# EAGLE design LN_Weiche_SignalMPX (EAGLE 7.7.0)
LocoNet Arduino Basisboard für piggyback PCBs
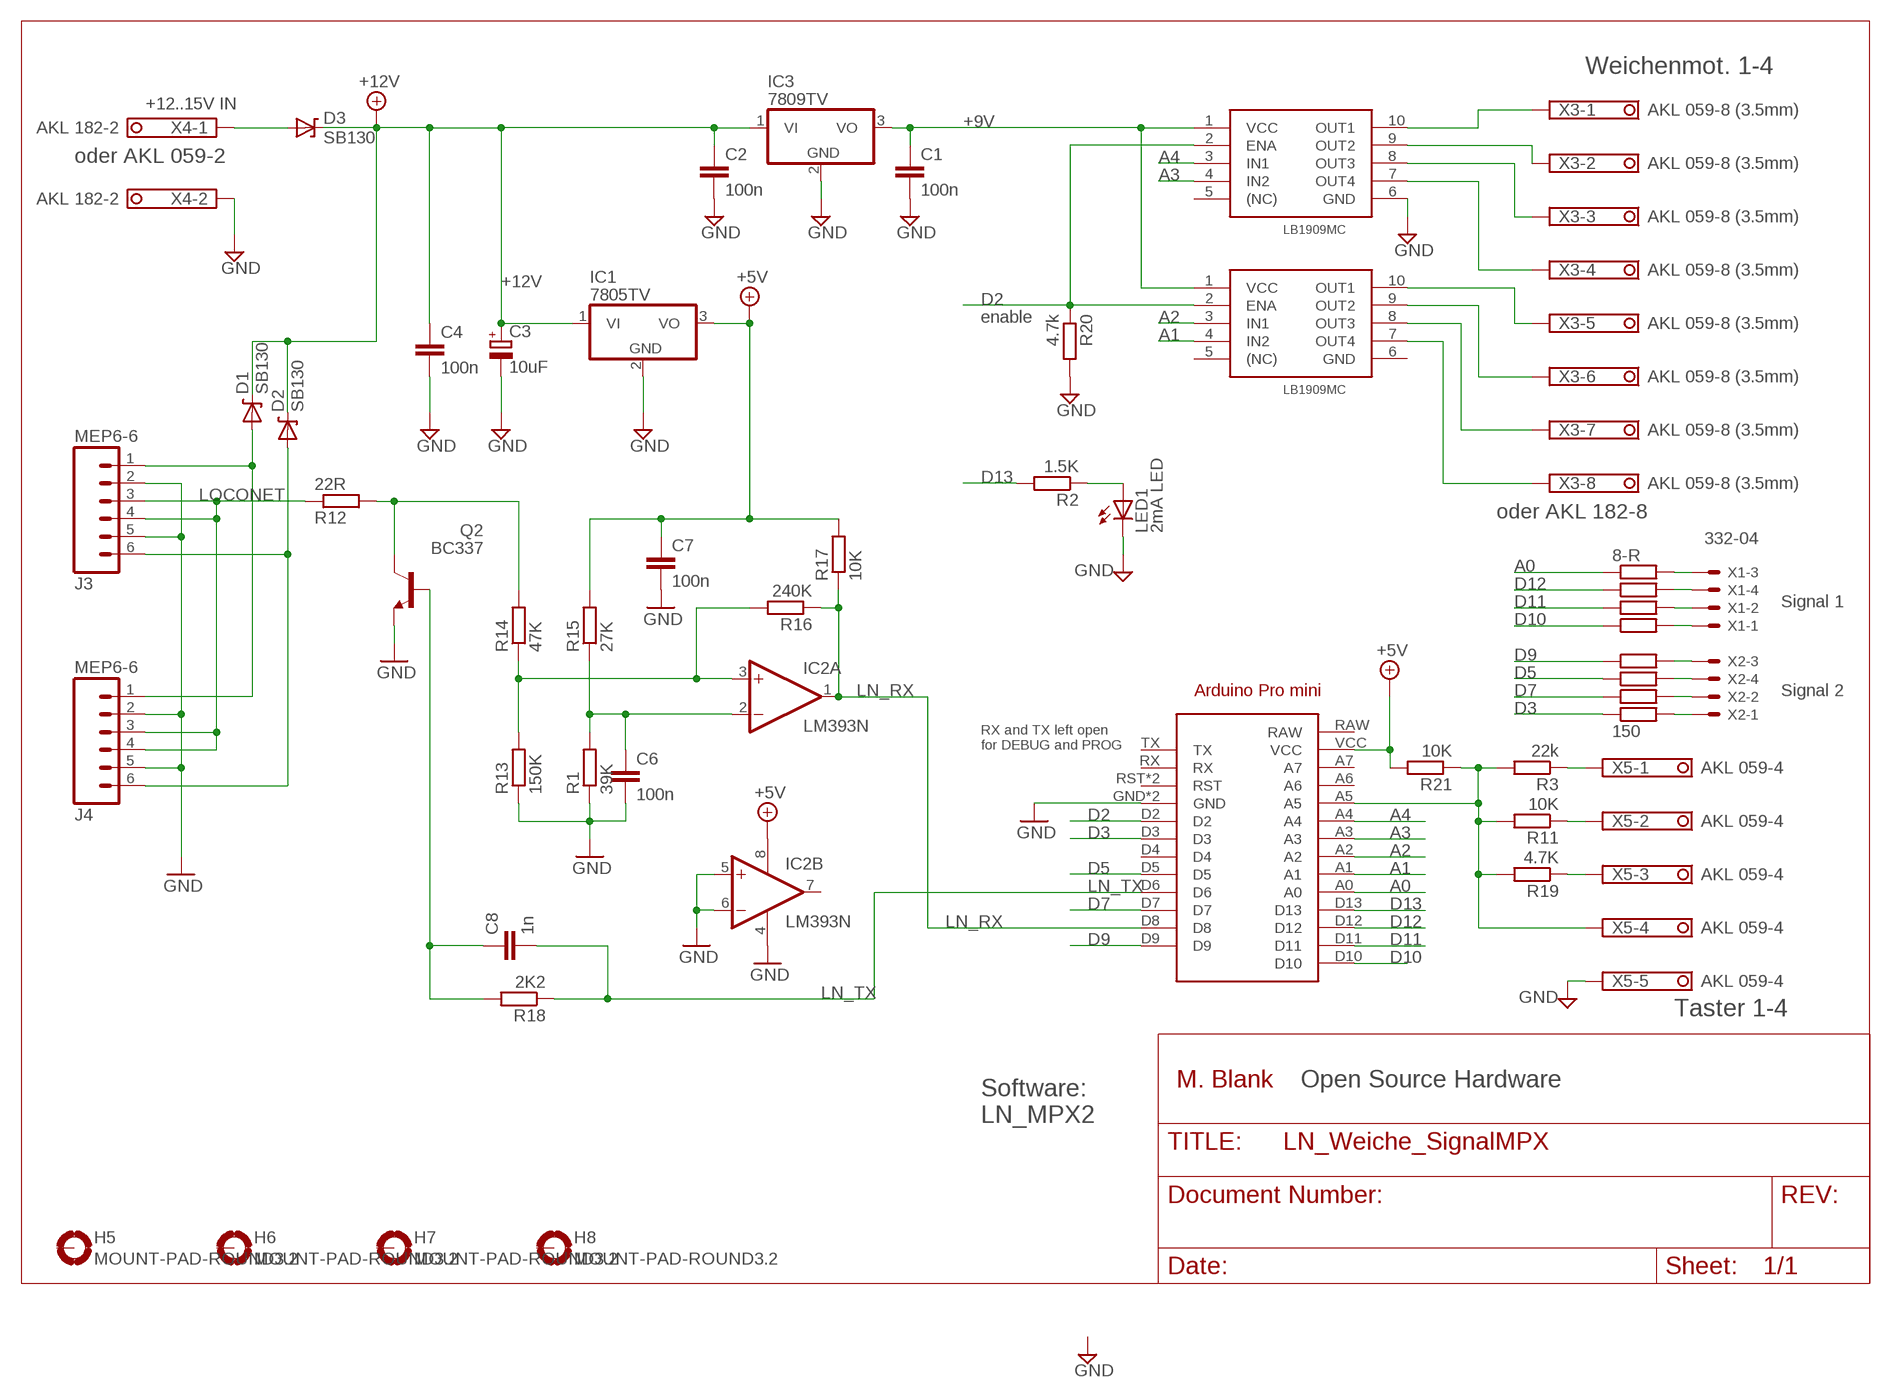
[diagram p0: schematic, sheet 1]

## Parts
8-R  150  R-EU_0207/10  [0207/10]
ARDUINO1  ARDUINO_PRO_MINI  [ARDUINO_PRO_MINI]
C1  100n  C-EU050-025X075  [C050-025X075]
C2  100n  C-EU050-025X075  [C050-025X075]
C3  10uF  CPOL-EUE2.5-7  [E2,5-7]
C4  100n  C-EU050-025X075  [C050-025X075]
C6  100n  C-EU050-025X075  [C050-025X075]
C7  100n  C-EU050-025X075  [C050-025X075]
C8  1n  C-EU025-025X050  [C025-025X050]
D1  SB130  DIODE-ZENERPTH  [DIODE-ZENER]
D2  SB130  DIODE-ZENERPTH  [DIODE-ZENER]
D3  SB130  DIODE-ZENERPTH  [DIODE-ZENER]
H5  MOUNT-PAD-ROUND3.2  [3,2-PAD]
H6  MOUNT-PAD-ROUND3.2  [3,2-PAD]
H7  MOUNT-PAD-ROUND3.2  [3,2-PAD]
H8  MOUNT-PAD-ROUND3.2  [3,2-PAD]
IC1  7805TV  [TO220V]
IC2  LM393N  [DIL08]
IC3  7809TV  7805TV  [TO220V]
J3  MEP6-6  RJ11-6PTH  [RJ11-6]
J4  MEP6-6  RJ11-6PTH  [RJ11-6]
LB1909MC-1  LB1909MC  LB1909SOIC10  [MSOIC10-1MM]
LB1909MC-2  LB1909MC  LB1909SOIC10  [MSOIC10-1MM]
LED1  2mA LED  LED3MM  [LED3MM]
Q2  BC337  [TO92]
R1  39K  R-EU_0207/10  [0207/10]
R2  1.5K  R-EU_0207/10  [0207/10]
R3  22k  R-EU_0207/10  [0207/10]
R4  150  R-EU_0207/10  [0207/10]
R5  150  R-EU_0207/10  [0207/10]
R6  150  R-EU_0207/10  [0207/10]
R7  150  R-EU_0207/10  [0207/10]
R8  150  R-EU_0207/10  [0207/10]
R9  150  R-EU_0207/10  [0207/10]
R10  150  R-EU_0207/10  [0207/10]
R11  10K  R-EU_0207/10  [0207/10]
R12  22R  R-EU_0207/10  [0207/10]
R13  150K  R-EU_0207/10  [0207/10]
R14  47K  R-EU_0207/10  [0207/10]
R15  27K  R-EU_0207/10  [0207/10]
R16  240K  R-EU_0207/10  [0207/10]
R17  10K  R-EU_0207/10  [0207/10]
R18  2K2  R-EU_0207/10  [0207/10]
R19  4.7K  R-EU_0207/10  [0207/10]
R20  4.7k  R-EU_0207/10  [0207/10]
R21  10K  R-EU_0207/10  [0207/10]
X1  332-04  [332-04]
X2  332-04  [332-04]
X3  AKL 059-8 (3.5mm)  1751303  [1751303]
X4  AKL 182-2  1751248  [1751248]
X5  AKL 059-4  1751277  [1751277]

## Nets
+5V: ARDUINO1.VCC C7.1 IC1.3(VO) IC2.8(P:V+) R15.2 R17.2 R21.2
+9V: C1.1 IC3.3(VO) LB1909MC-1.1(VCC) LB1909MC-2.1(VCC)
+12V: C2.1 C3.+ C4.1 D1.P$1(C) D2.P$1(C) D3.P$1(C) IC1.1(VI) IC3.1(VI)
A0: 8-R.1 ARDUINO1.A0
A1: ARDUINO1.A1 LB1909MC-2.4(IN2)
A2: ARDUINO1.A2 LB1909MC-2.3(IN1)
A3: ARDUINO1.A3 LB1909MC-1.4(IN2)
A4: ARDUINO1.A4 LB1909MC-1.3(IN1)
D2: ARDUINO1.D2 LB1909MC-1.2(ENA) LB1909MC-2.2(ENA) R20.1
D3: ARDUINO1.D3 R10.1
D5: ARDUINO1.D5 R8.1
D7: ARDUINO1.D7 R9.1
D9: ARDUINO1.D9 R7.1
D10: ARDUINO1.D10 R6.1
D11: ARDUINO1.D11 R5.1
D12: ARDUINO1.D12 R4.1
D13: ARDUINO1.D13 R2.2
GND: ARDUINO1.GND ARDUINO1.GND@1(GND) C1.2 C2.2 C3.- C4.2 C6.2 C7.2 IC1.2(GND) IC2.4(P:V-) IC2.5(B:+IN) IC2.6(B:-IN) IC3.2(GND) J3.2 J3.5 J4.2 J4.5 LB1909MC-1.6(GND) LED1.K(C) Q2.1(E) R1.1 R13.1 R20.2 X4.2 X5.5
LN_RX: ARDUINO1.D8 IC2.1(A:OUT) R16.1 R17.1
LN_TX: ARDUINO1.D6 C8.2 R18.1
LOCONET: J3.3 J3.4 J4.3 J4.4 R12.1
N$1: LED1.A R2.1
N$2: LB1909MC-1.10(OUT1) X3.1
N$3: LB1909MC-1.9(OUT2) X3.2
N$4: LB1909MC-1.8(OUT3) X3.3
N$5: LB1909MC-1.7(OUT4) X3.4
N$6: 8-R.2 X1.3
N$7: R4.2 X1.4
N$8: R5.2 X1.2
N$9: R6.2 X1.1
N$10: D3.P$2(A) X4.1
N$11: R7.2 X2.3
N$12: R8.2 X2.4
N$13: R9.2 X2.2
N$14: R10.2 X2.1
N$15: LB1909MC-2.10(OUT1) X3.5
N$16: LB1909MC-2.9(OUT2) X3.6
N$17: LB1909MC-2.8(OUT3) X3.7
N$18: LB1909MC-2.7(OUT4) X3.8
N$19: ARDUINO1.A5 R3.2 R11.2 R19.2 R21.1 X5.4
N$20: R3.1 X5.1
N$21: R11.1 X5.2
N$22: R19.1 X5.3
N$28: D1.P$2(A) J3.1 J4.1
N$29: C6.1 IC2.2(A:-IN) R1.2 R15.1
N$30: C8.1 Q2.2(B) R18.2
N$32: IC2.3(A:+IN) R13.2 R14.1 R16.2
N$36: Q2.3(C) R12.2 R14.2
N$37: D2.P$2(A) J3.6 J4.6
Unconnected: ARDUINO1.A6 ARDUINO1.A7 ARDUINO1.D4 ARDUINO1.RAW ARDUINO1.RST ARDUINO1.RST@1(RST) ARDUINO1.RX ARDUINO1.TX H5.B3,2(MOUNT) H6.B3,2(MOUNT) H7.B3,2(MOUNT) H8.B3,2(MOUNT) IC2.7(B:OUT) LB1909MC-1.5((NC)) LB1909MC-2.5((NC))

## Notes on the sheet
- Weichenmot. 1-4
- +12..15V IN
- oder AKL 059-2
- enable
- oder AKL 182-8
- Signal 1
- Signal 2
- RX and TX left open
  for DEBUG and PROG
- Taster 1-4
- M. Blank | Open Source Hardware
- Software: 
  LN_MPX2

## Power pins joined to a net without a drawn wire
GND: LB1909MC-2.6(GND)

## Library data of the parts
8-R R4-R10 R20 = resistor:R-EU_: RESISTOR, European symbol
ARDUINO1 = lib-arduino-pro-mini67:ARDUINO_PRO_MINI: For creating Arduino Pro Mini shields
C1 = resistor:C-EU: CAPACITOR, European symbol
C2 C4 C6-C8 = rcl:C-EU: CAPACITOR, European symbol
C3 = resistor:CPOL-EU: POLARIZED CAPACITOR, European symbol
D1-D3 = SparkFun-DiscreteSemi:DIODE-ZENER: Zener Diode Production Part - 8199 3.4V Zener Voltage
H5-H8 = holes:MOUNT-PAD-ROUND: MOUNTING PAD, round
IC1 IC3 = linear:78*: Positive VOLTAGE REGULATOR Source: http://cache.national.com/ds/LM/LM78L05.pdf http://www.fairchildsemi.com/ds/LM/LM7805.pdf
IC2 = linear:LM393: COMPARATOR
J3 J4 = SparkFun-Connectors:RJ11-6: RJ11 Jack Simple 6 pin RJ11 jack. Commonly found on CAT3 devices and Microchip programmers. SKU: PRT-00132
LB1909MC-1 LB1909MC-2 = lb1909:LB1909: LB1909MC Motor Driver
LED1 = led:LED: LED OSRAM: - CHIPLED LG R971, LG N971, LY N971, LG Q971, LY Q971, LO R971, LY R971 LH N974, LH R974 LS Q976, LO Q976, LY Q976 LO Q996 - Hyper CHIPLED LW Q18S LB Q993, LB Q99A, LB R99A - SideLED LS A670, LO A670, LY A670, LG A670, LP A670 LB A673, LV A673, LT A673, LW A673 LH A674 LY A675 LS A676, LA A676, LO A676, LY A676, LW A676 LS A679, LY A679, LG A679 - Hyper Micro SIDELED® LS Y876, LA Y876, LO Y876, LY Y876 LT Y87S - SmartLED LW L88C, LW L88S LB L89C, LB L89S, LG L890 LS L89K, LO L89K, LY L89K LS L896, LA L896, LO L896, LY L896 - TOPLED LS T670, LO T670, LY T670, LG T670, LP T670 LSG T670, LSP T670, LSY T670, LOP T670, LYG T670 LG T671, LOG T671, LSG T671 LB T673, LV T673, LT T673, LW T673 LH T674 LS T676, LA T676, LO T676, LY T676, LB T676, LH T676, LSB T676, LW T676 LB T67C, LV T67C, LT T67C, LS T67K, LO T67K, LY T67K, LW E67C LS E67B, LA E67B, LO E67B, LY E67B, LB E67C, LV E67C, LT E67C LW T67C LS T679, LY T679, LG T679 LS T770, LO T770, LY T770, LG T770, LP T770 LB T773, LV T773, LT T773, LW T773 LH T774 LS E675, LA E675, LY E675, LS T675 LS T776, LA T776, LO T776, LY T776, LB T776 LHGB T686 LT T68C, LB T68C - Hyper Mini TOPLED® LB M676 - Mini TOPLED Santana® LG M470 LS M47K, LO M47K, LY M47K Source: http://www.osram.convergy.de LUXEON: - LUMILED® LXK2-PW12-R00, LXK2-PW12-S00, LXK2-PW14-U00, LXK2-PW14-V00 LXK2-PM12-R00, LXK2-PM12-S00, LXK2-PM14-U00 LXK2-PE12-Q00, LXK2-PE12-R00, LXK2-PE12-S00, LXK2-PE14-T00, LXK2-PE14-U00 LXK2-PB12-K00, LXK2-PB12-L00, LXK2-PB12-M00, LXK2-PB14-N00, LXK2-PB14-P00, LXK2-PB14-Q00 LXK2-PR12-L00, LXK2-PR12-M00, LXK2-PR14-Q00, LXK2-PR14-R00 LXK2-PD12-Q00, LXK2-PD12-R00, LXK2-PD12-S00 LXK2-PH12-R00, LXK2-PH12-S00 LXK2-PL12-P00, LXK2-PL12-Q00, LXK2-PL12-R00 Source: www.luxeon.com KINGBRIGHT: KA-3528ASYC Source: www.kingbright.com
Q2 = transistor-npn:BC337*: NPN Transistor
R1-R3 R11-R19 R21 = rcl:R-EU_: RESISTOR, European symbol
X1 X2 = con-garry:332-04: 4 Pin - 2mm Dual Row Source: www.mpe-connector.de / garry_shortform_2012.pdf
X3 = con-phoenix-350-grosse-bohrungen:1751303: MKDS 1/ 8-3,5 Printklemme Nennstrom: 10 A Bemessungsspannung: 160 V Raster: 3,5 mm Polzahl: 8 Montageart: Löten Anschlussart: Schraubanschluss Anschlussrichtung vom Leiter zur Platine: 0° Source: http://eshop.phoenixcontact.com .. .pdf; OC_FARNELL: unknown; OC_NEWARK: unknown
X4 = con-phoenix-350-grosse-bohrungen:1751248: MKDS 1/ 2-3,5 Printklemme Nennstrom: 10 A Bemessungsspannung: 160 V Raster: 3,5 mm Polzahl: 2 Montageart: Löten Anschlussart: Schraubanschluss Anschlussrichtung vom Leiter zur Platine: 0° Source: http://eshop.phoenixcontact.com .. 1751248.pdf; OC_FARNELL: unknown; OC_NEWARK: unknown
X5 = con-phoenix-350-grosse-bohrungen:1751277: MKDS 1/ 5-3,5 Printklemme Nennstrom: 10 A Bemessungsspannung: 160 V Raster: 3,5 mm Polzahl: 5 Montageart: Löten Anschlussart: Schraubanschluss Anschlussrichtung vom Leiter zur Platine: 0° Source: http://eshop.phoenixcontact.com .. 1751277.pdf; OC_FARNELL: unknown; OC_NEWARK: unknown

## Board
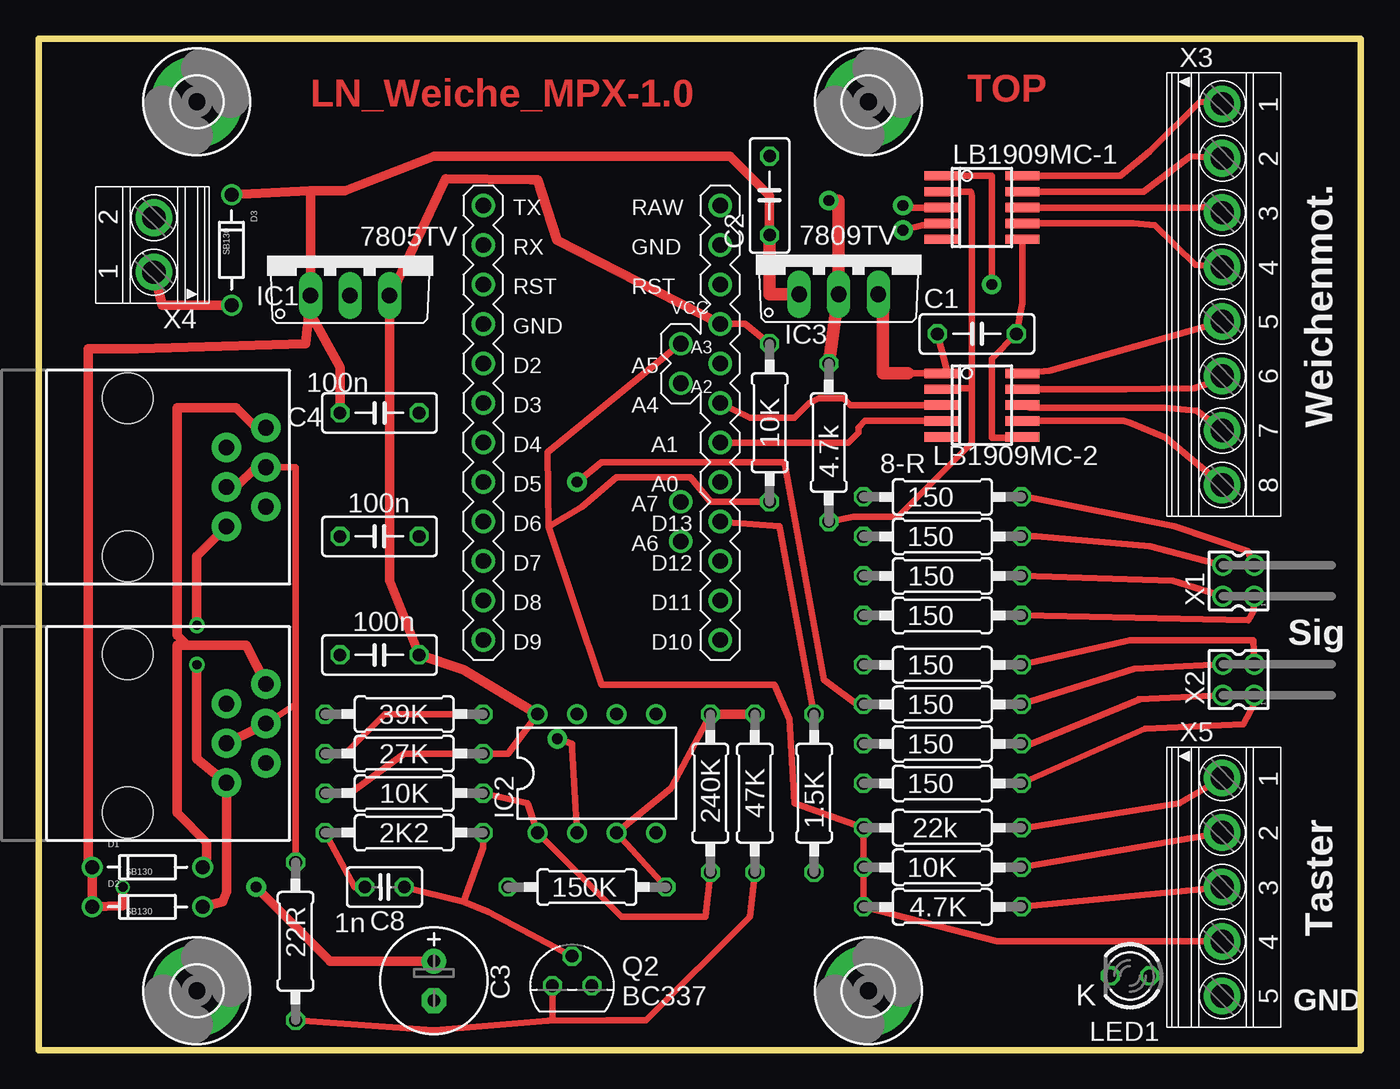
[diagram p1: board, top side]
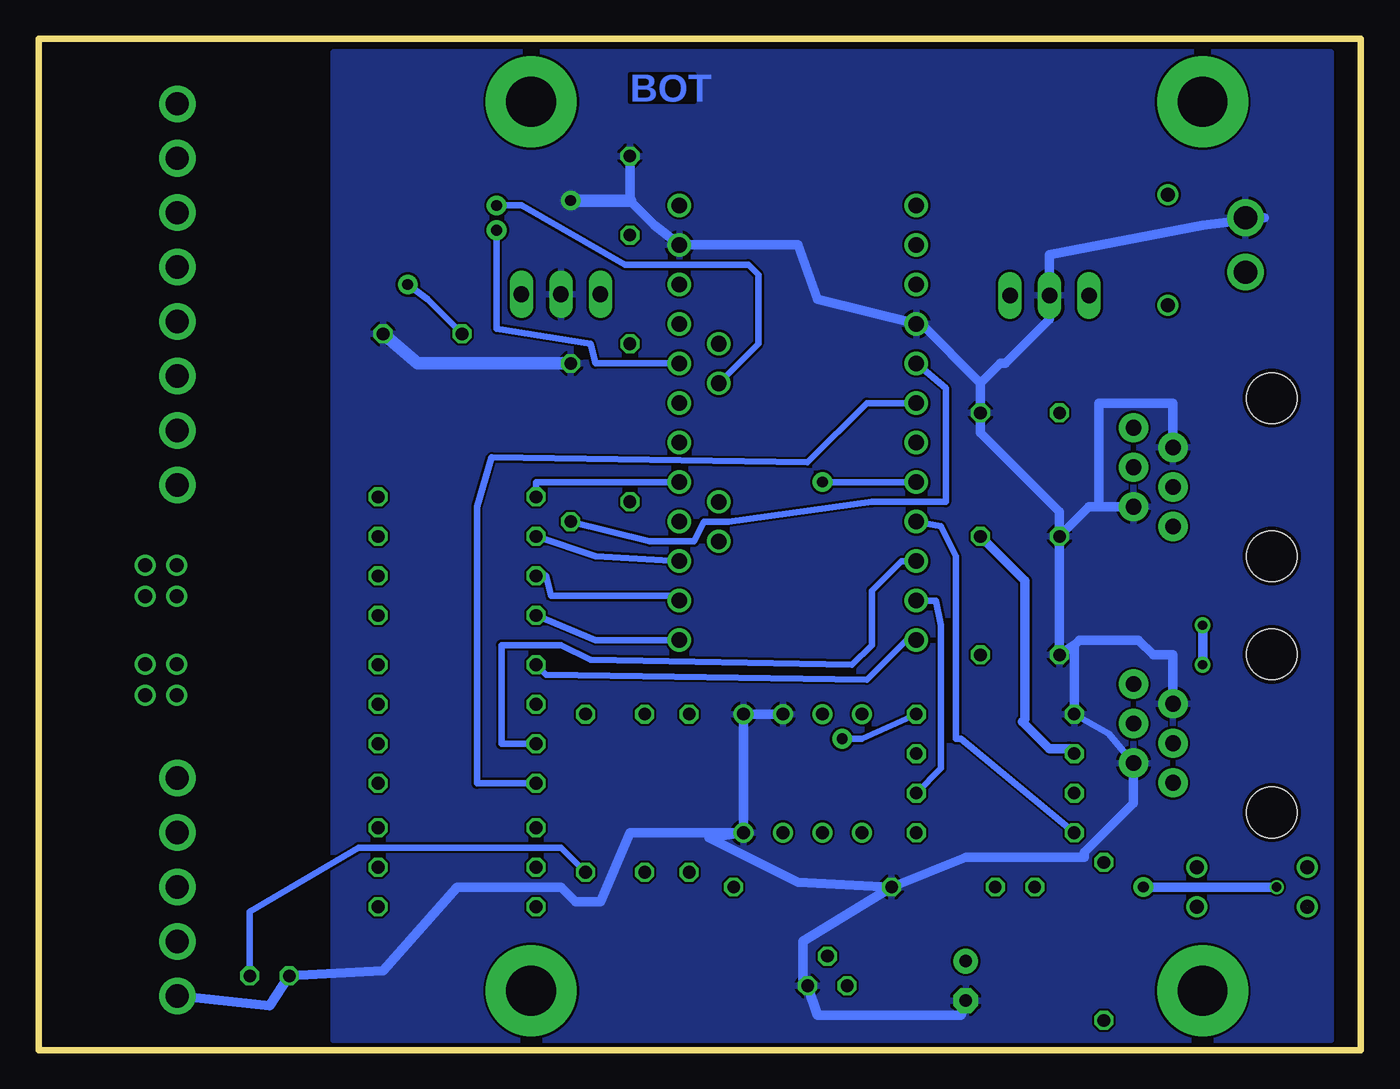
[diagram p2: board, bottom side, seen from below]

Size 85 x 65 mm. Coordinates in mm from the lower left corner, seen from the top.
Outline: 0,0 85,0 85,65 0,65 0,0
Copper layers (1*16): Top 0.018mm / dielectric 1.55mm / Bottom 0.018mm
Design rules "eC_2Layer_PClass6_BaseCopperO18_eCDefault": minimum track width 0.15mm, minimum drill 0.35mm, track to track 0.15mm, track to pad 0.15mm, pad to pad 0.15mm, via to via 0.15mm, smd to smd 0mil, copper to edge 0.25mm, drill to drill 0.35mm, minimum pad ring 0.175mm, minimum via ring 0.125mm, stop-mask expansion 0mil, vias tented up to drill 0.45mm, thermal gap 0.2mm

### Footprints (pad centres in the part's own frame; a part is rotated, then mirrored left to right if it is on the bottom)
0207/10 = drill 0.813 octagon: 1 -5.08,0; 2 5.08,0
ARDUINO_PRO_MINI = drill 1: A0 11.43,-8.89; A1 11.43,-6.35; A2 11.43,-3.81; A3 11.43,-1.27; A4 8.89,-2.54; A5 8.89,0; A6 8.89,-12.7; A7 8.89,-10.16; D2 -3.81,-1.27; D3 -3.81,-3.81; D4 -3.81,-6.35; D5 -3.81,-8.89; D6 -3.81,-11.43; D7 -3.81,-13.97; D8 -3.81,-16.51; D9 -3.81,-19.05; D10 11.43,-19.05; D11 11.43,-16.51; D12 11.43,-13.97; D13 11.43,-11.43; GND -3.81,1.27; GND@1 11.43,6.35; RAW 11.43,8.89; RST 11.43,3.81; RST@1 -3.81,3.81; RX -3.81,6.35; TX -3.81,8.89; VCC 11.43,1.27
C050-025X075 = drill 0.813 octagon: 1 -2.54,0; 2 2.54,0
E2,5-7 = drill 0.813 pad 1.6: + -1.27,0 | drill 0.813 pad 1.6 octagon: - 1.27,0
C025-025X050 = drill 0.813 octagon: 1 -1.27,0; 2 1.27,0
DIODE-ZENER = drill 0.9: P$1 -3.556,0; P$2 3.556,0
3,2-PAD = drill 3.2 pad 5.842: B3,2 0,0
TO220V = drill 1.016 long: 1 -2.54,-2.54; 2 0,-2.54; 3 2.54,-2.54
DIL08 = drill 0.813 pad 1.27: 1 -3.81,-3.81; 2 -1.27,-3.81; 3 1.27,-3.81; 4 3.81,-3.81; 5 3.81,3.81; 6 1.27,3.81; 7 -1.27,3.81; 8 -3.81,3.81
RJ11-6 = drill 1.016 pad 1.88: 1 1.905,8.89; 2 3.175,6.35; 3 4.445,8.89; 4 5.715,6.35; 5 6.985,8.89; 6 8.255,6.35 | hole 3.251: 0,0; 10.16,0
MSOIC10-1MM = smd 0.6 x 2.2: 1 -1.905,-2.6; 2 -0.885,-2.6; 3 0.135,-2.6; 4 1.155,-2.6; 5 2.175,-2.6; 6 2.175,2.6; 7 1.155,2.6; 8 0.135,2.6; 9 -0.885,2.6; 10 -1.905,2.6
LED3MM = drill 0.813 octagon: A -1.27,0; K 1.27,0
TO92 = drill 0.813 octagon: 1 1.27,0; 2 0,1.905; 3 -1.27,0
332-04 = drill 0.9 pad 1.27: 1 -1,-1; 2 -1,1; 3 1,-1; 4 1,1
1751303 = drill 1.5 pad 2.35: 1 -12.25,-0.1; 2 -8.75,-0.1; 3 -5.25,-0.1; 4 -1.75,-0.1; 5 1.75,-0.1; 6 5.25,-0.1; 7 8.75,-0.1; 8 12.25,-0.1
1751248 = drill 1.5 pad 2.35: 1 -1.75,-0.1; 2 1.75,-0.1
1751277 = drill 1.5 pad 2.35: 1 -7,-0.1; 2 -3.5,-0.1; 3 0,-0.1; 4 3.5,-0.1; 5 7,-0.1

### Placement (x,y rotation side)
8-R  58.1,35.56 0 top
ARDUINO1  32.38,45.4 0 top
C1  60.33,46.04 0 top
C2  46.99,54.93 90 top
C3  25.4,4.45 270 top
C4  21.91,40.96 0 top
C6  21.91,33.02 180 top
C7  21.91,25.4 180 top
C8  22.23,10.48 180 top
D1  6.99,11.75 0 top
D2  6.99,9.2 0 top
D3  12.38,51.44 270 top
H5  10.16,60.96 0 top
H6  53.34,60.96 0 top
H7  10.16,3.81 0 top
H8  53.34,3.81 0 top
IC1  20,51.05 0 top
IC2  35.88,17.78 0 top
IC3  51.44,51.12 0 top
J3  5.71,41.91 270 top
J4  5.71,25.43 270 top
LB1909MC-1  60.64,54.29 270 top
LB1909MC-2  60.64,41.59 270 top
LED1  70.17,4.76 180 top
Q2  34.29,4.13 0 top
R1  23.5,21.59 0 top
R2  49.85,16.51 90 top
R3  58.1,14.29 180 top
R4  58.1,33.02 0 top
R5  58.1,30.48 0 top
R6  58.1,27.94 0 top
R7  58.1,24.77 0 top
R8  58.1,22.23 0 top
R9  58.1,19.68 0 top
R10  58.1,17.14 0 top
R11  58.1,11.75 180 top
R12  16.51,6.99 270 top
R13  35.24,10.48 0 top
R14  46.04,16.51 270 top
R15  23.5,19.05 0 top
R16  43.18,16.51 90 top
R17  23.5,16.51 180 top
R18  23.5,13.97 0 top
R19  58.1,9.21 180 top
R20  50.8,39.05 90 top
R21  46.99,40.32 90 top
X1  77.15,30.16 90 top
X2  77.15,23.81 90 top
X3  76.2,48.58 270 top
X4  7.3,51.75 90 top
X5  76.2,10.48 270 top

### Tracks (layer width: path | path; a pad name or v marks a point on that pad's centre or on a via)
+5V
  Top 0.406: R17.2 20,16.51 23.5,19.05 R15.2 30.16,19.05 IC2.8 | R21.2 45.4,46.67 ARDUINO1.VCC
  Top 0.61: ARDUINO1.VCC 33.34,52.07 32.07,55.93 31.62,55.93 26.16,55.99 22.57,48.37 22.54,48.67 IC1.3 22.54,30.16 C7.1 27.3,24.45 IC2.8
+9V  (via drill 0.7 pad 1.27)
  Top 0.406: LB1909MC-1.1 61.28,56.2 v61.28,49.21 | C1.1 58.42,43.56 LB1909MC-2.1 55.9,43.5
  Top 0.813: IC3.3 54.29,48.58 54.29,43.5 55.9,43.5
  Bottom 0.406: v61.28,49.21 60.01,48.26 C1.1
+12V  (via drill 0.6, 0.7 pad 1.27)  (1 unrouted)
  Top 0.406: 17.4,47.43 17.14,45.4
  Top 0.61: 3.17,12.06 3.17,45.09 6.35,45.09 17.14,45.4 IC1.1 17.46,55.24 | 3.49,11.75 3.17,12.06 | 3.17,12.06 D1.P$1 D2.P$1 5.4,9.27 v5.4,10.48 | C3.+ 18.73,5.71 v13.97,10.48 | C2.1 46.99,54.93 44.45,57.47 25.4,57.47 19.68,55.24 17.46,55.24 | 17.46,55.24 17.4,55.24 D3.P$1 | C4.1 19.37,43.88 17.4,47.43
  Top 0.813: IC3.1 46.99,48.58 C2.1
  Bottom 0.61: v13.97,10.48 v5.4,10.48
A0
  Bottom 0.406: ARDUINO1.A0 53.02,36.51 8-R.1
A1
  Top 0.406: LB1909MC-2.4 53.14,40.44 52.7,40.01 52.7,39.69 52.07,39.05 ARDUINO1.A1
A2
  Top 0.406: LB1909MC-2.3 52.2,41.46 51.75,41.91 50.16,41.91 49.53,41.59 48.58,40.64 45.72,40.64 ARDUINO1.A2
A3  (via drill 0.7 pad 1.27)
  Top 0.406: v55.56,52.7 56.83,53.02 58.24,53.02 LB1909MC-1.4
  Bottom 0.406: ARDUINO1.A3 49.21,44.13 49.53,45.4 55.56,46.35 v55.56,52.7
A4  (via drill 0.7 pad 1.27)
  Top 0.406: LB1909MC-1.3 56.02,54.16 v55.56,54.29
  Bottom 0.406: v55.56,54.29 53.98,54.29 47.31,50.48 39.37,50.48 38.73,49.85 38.73,45.4 ARDUINO1.A4
D2
  Top 0.406: R20.1 52.39,34.29 55.24,34.29 60.01,39.05 60.01,42.55 | 60.01,42.55 58.61,42.55 LB1909MC-2.2 | LB1909MC-1.2 59.94,55.18 60.01,54.93 60.01,42.55
  Bottom 0.406: ARDUINO1.D2 26.67,42.55 26.67,35.24 31.43,35.24 40.64,33.97 42.23,33.97 42.86,32.7 45.72,32.7 R20.1
D3
  Bottom 0.406: R10.1 56.83,17.14 56.83,34.92 55.88,38.1 35.56,37.78 31.75,41.59 ARDUINO1.D3
D5  (via drill 0.7 pad 1.27)
  Top 0.406: R8.1 53.02,21.91 50.48,23.81 47.94,37.78 36.2,37.78 v34.61,36.51
  Bottom 0.406: v34.61,36.51 ARDUINO1.D5
D7
  Bottom 0.406: ARDUINO1.D7 29.53,31.43 31.43,29.53 31.43,26.04 32.7,24.77 49.53,25.08 51.44,26.04 55.24,26.04 55.24,19.68 R9.1
D9
  Bottom 0.406: ARDUINO1.D9 29.21,26.35 31.75,23.81 52.39,24.13 R7.1
D10
  Bottom 0.406: ARDUINO1.D10 49.21,26.35 R6.1
D11
  Bottom 0.406: R5.1 52.39,30.48 52.07,29.21 44.13,29.21 ARDUINO1.D11
D12
  Bottom 0.406: ARDUINO1.D12 49.21,31.75 R4.1
D13
  Top 0.406: ARDUINO1.D13 47.62,33.66 R2.2
GND  (via drill 0.7 pad 1.27)
  Top 0.406: LB1909MC-1.6 63.24,48 C1.2 61.28,44.45 61.28,39.37 63.51,39.37 LB1909MC-2.6
  Top 0.813: v50.8,54.61 51.44,54.61 IC3.2 R20.2
  Bottom 0.406: R1.1 16.19,20.32 J4.5
  Bottom 0.61: C3.- 25.72,2.22 34.92,2.22 Q2.1 35.88,4.45 35.88,6.99 R13.1 | R13.1 36.2,10.79 41.91,13.65 IC2.4 | IC2.4 IC2.5 IC2.6 | IC2.4 46.99,13.97 48.9,9.53 50.48,9.53 51.44,10.48 58.1,10.48 62.87,5.08 LED1.K 70.17,2.86 X5.5 | C6.2 C7.2 18.41,26.04 | C2.2 46.99,54.61 45.4,53.02 ARDUINO1.GND@1 36.2,51.75 34.92,48.26 ARDUINO1.GND | 28.26,46.67 24.45,42.86 | 24.45,42.86 C4.2 24.45,39.69 19.37,34.61 C6.2 | C6.2 17.46,34.92 16.83,34.92 | J3.2 12.06,41.59 16.83,41.59 16.83,34.92 | 16.83,34.92 J3.5 | X4.2 6.19,53.5 10.16,53.02 20,51.12 IC1.2 20,46.99 22.86,44.13 23.18,44.13 24.45,42.86 | 18.41,26.04 R1.1 | J4.2 12.06,25.4 13.34,25.4 14.29,26.35 18.1,26.35 18.41,26.04 | R13.1 25.4,12.38 17.78,12.38 17.78,12.7 14.61,15.88 J4.5
  Bottom 0.813: 46.99,54.61 v50.8,54.61 | R20.2 60.64,44.13 C1.2
  pour Bottom: 1.91,64.14 66.04,64.14 66.04,0.64 1.91,0.64
LN_RX
  Top 0.406: R16.1 42.86,8.57 37.47,8.57 IC2.1 31.43,15.88 R17.1
  Bottom 0.406: R17.1 26.99,18.1 26.99,27.3 27.3,28.89 ARDUINO1.D8
LN_TX
  Top 0.406: C8.2 20.32,10.48 R18.1
  Bottom 0.406: R18.1 25.72,20 26.04,20 26.04,31.75 26.99,33.66 ARDUINO1.D6
LOCONET
  Top 0.406: R12.1 16.51,22.23 | J4.3 16.51,22.23 | 16.51,22.23 16.51,37.47 J3.3
  Top 0.61: J3.3 13.97,37.47 12.7,36.2 J3.4 | J4.3 13.97,20.64 J4.4
N$1
  Bottom 0.406: R2.1 51.44,13.02 64.45,13.02 71.44,8.89 LED1.A
N$2
  Top 0.406: LB1909MC-1.10 69.53,56.2 71.44,57.78 74.64,60.96 X3.1
N$3
  Top 0.406: LB1909MC-1.9 71.05,55.18 71.12,55.24 74.06,57.47 X3.2
N$4
  Top 0.406: LB1909MC-1.8 74.43,54.16 76.2,54.29 76.27,54.29 X3.3
N$5
  Top 0.406: LB1909MC-1.7 70.37,53.14 71.75,53.02 74.36,50.48 X3.4
N$6
  Top 0.406: 8-R.2 63.5,35.56 73.03,33.66 77.79,32.07 78.11,30.8 X1.3
N$7
  Top 0.406: R4.2 64.14,33.02 71.44,32.38 76.2,31.11 X1.4
N$8
  Top 0.406: R5.2 72.93,30.16 X1.2
N$9
  Top 0.406: R6.2 77.79,27.62 78.11,28.16 X1.1
N$10
  Top 0.61: D3.P$2 7.94,47.88 X4.1
N$11
  Top 0.406: X2.3 78.15,25.04 78.11,26.35 70.17,26.35 R7.2
N$12
  Top 0.406: X2.4 70.44,24.5 R8.2
N$13
  Top 0.406: R9.2 63.82,19.68 70.8,22.54 70.71,22.54 X2.2
N$14
  Top 0.406: X2.1 78.15,22.27 77.47,20.95 71.12,20.64 R10.2
N$15
  Top 0.406: X3.5 64.98,43.65 LB1909MC-2.10
N$16
  Top 0.406: LB1909MC-2.9 69.92,42.48 74.3,42.55 76.27,43.18 X3.6
N$17
  Top 0.406: X3.7 74.47,41.1 72.39,41.27 63.74,41.27 LB1909MC-2.8
N$18
  Top 0.406: LB1909MC-2.7 69.73,40.44 70.17,40.32 72.47,39.37 X3.8
N$19
  Top 0.406: X5.4 61.59,6.99 R19.2 R11.2 R3.2 48.58,15.88 48.26,21.27 47.31,23.5 36.2,23.5 32.78,33.64 | ARDUINO1.A5 32.7,38.42 32.78,33.64 | R21.1 43.18,35.24 41.91,36.83 37.15,36.83 34.92,34.92 32.78,33.64
N$20
  Top 0.406: R3.1 63.5,14.29 73.34,15.88 X5.1
N$21
  Top 0.406: X5.2 R11.1
N$22
  Top 0.406: X5.3 R19.1
N$28
  Top 0.61: J3.1 13.97,40.01 12.7,41.27 8.89,41.27 8.89,26.67 9.53,26.04 | 9.53,26.04 13.34,26.04 J4.1 | 9.53,26.04 8.89,26.04 8.89,15.24 10.79,13.34 10.79,12.32 D1.P$2
N$29  (via drill 0.7 pad 1.27)
  Top 0.406: R1.2 22.23,21.59 19.68,19.05 R15.1 | IC2.2 34.29,19.37 34.29,19.68 v33.34,20
  Bottom 0.406: v33.34,20 32.07,20 R1.2
  Bottom 0.61: C6.1 21.59,30.16 21.59,21.27 21.75,21.11 20,19.37 18.73,19.37 R15.1
N$30
  Top 0.406: Q2.2 28.89,8.89 27.3,9.53 | 27.3,9.53 C8.1 | 27.3,9.53 28.57,13.02 R18.2
N$32
  Top 0.406: R16.2 40.64,16.83 IC2.3 R13.2
  Top 0.61: R14.1 R16.2
N$36
  Top 0.406: R12.2 25.4,1.27 32.74,1.89 | R14.2 45.72,8.57 39.05,1.91 36.51,1.91 32.74,1.89 | Q2.3 33.02,1.93 32.74,1.89
N$37  (via drill 0.6 pad 1.02)
  Top 0.61: J4.6 12.06,17.14 | 12.06,17.14 12.06,10.16 11.81,9.53 D2.P$2 | J3.6 10.16,31.75 v10.16,27.3 | v10.16,24.77 10.16,18.73 12.06,17.14
  Bottom 0.61: v10.16,27.3 v10.16,24.77

### Text on the board
Top: LN_Weiche_MPX-1.0 | TOP
Bottom: BOT
tNames: Weichenmot. | Sig | Taster | K | GND